# EasyEDA Pro project PCB.epro

# Board PCB1
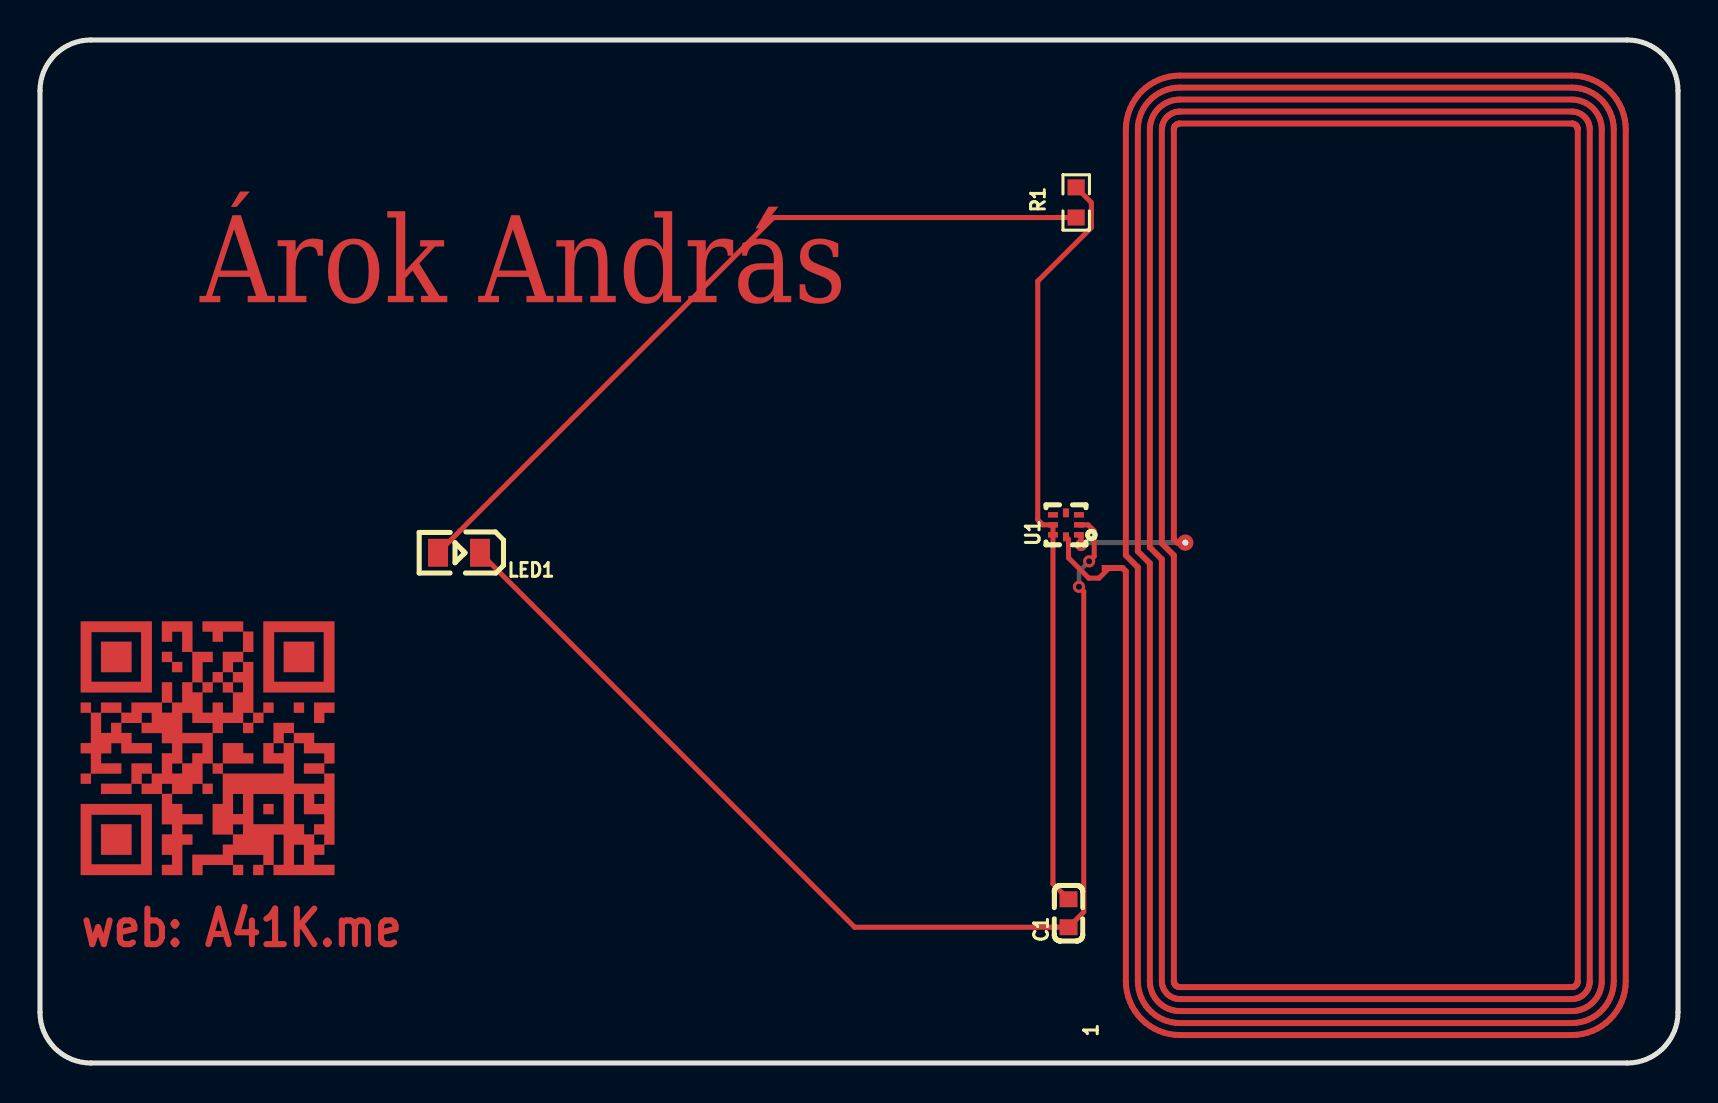
[diagram p0: board, top side]
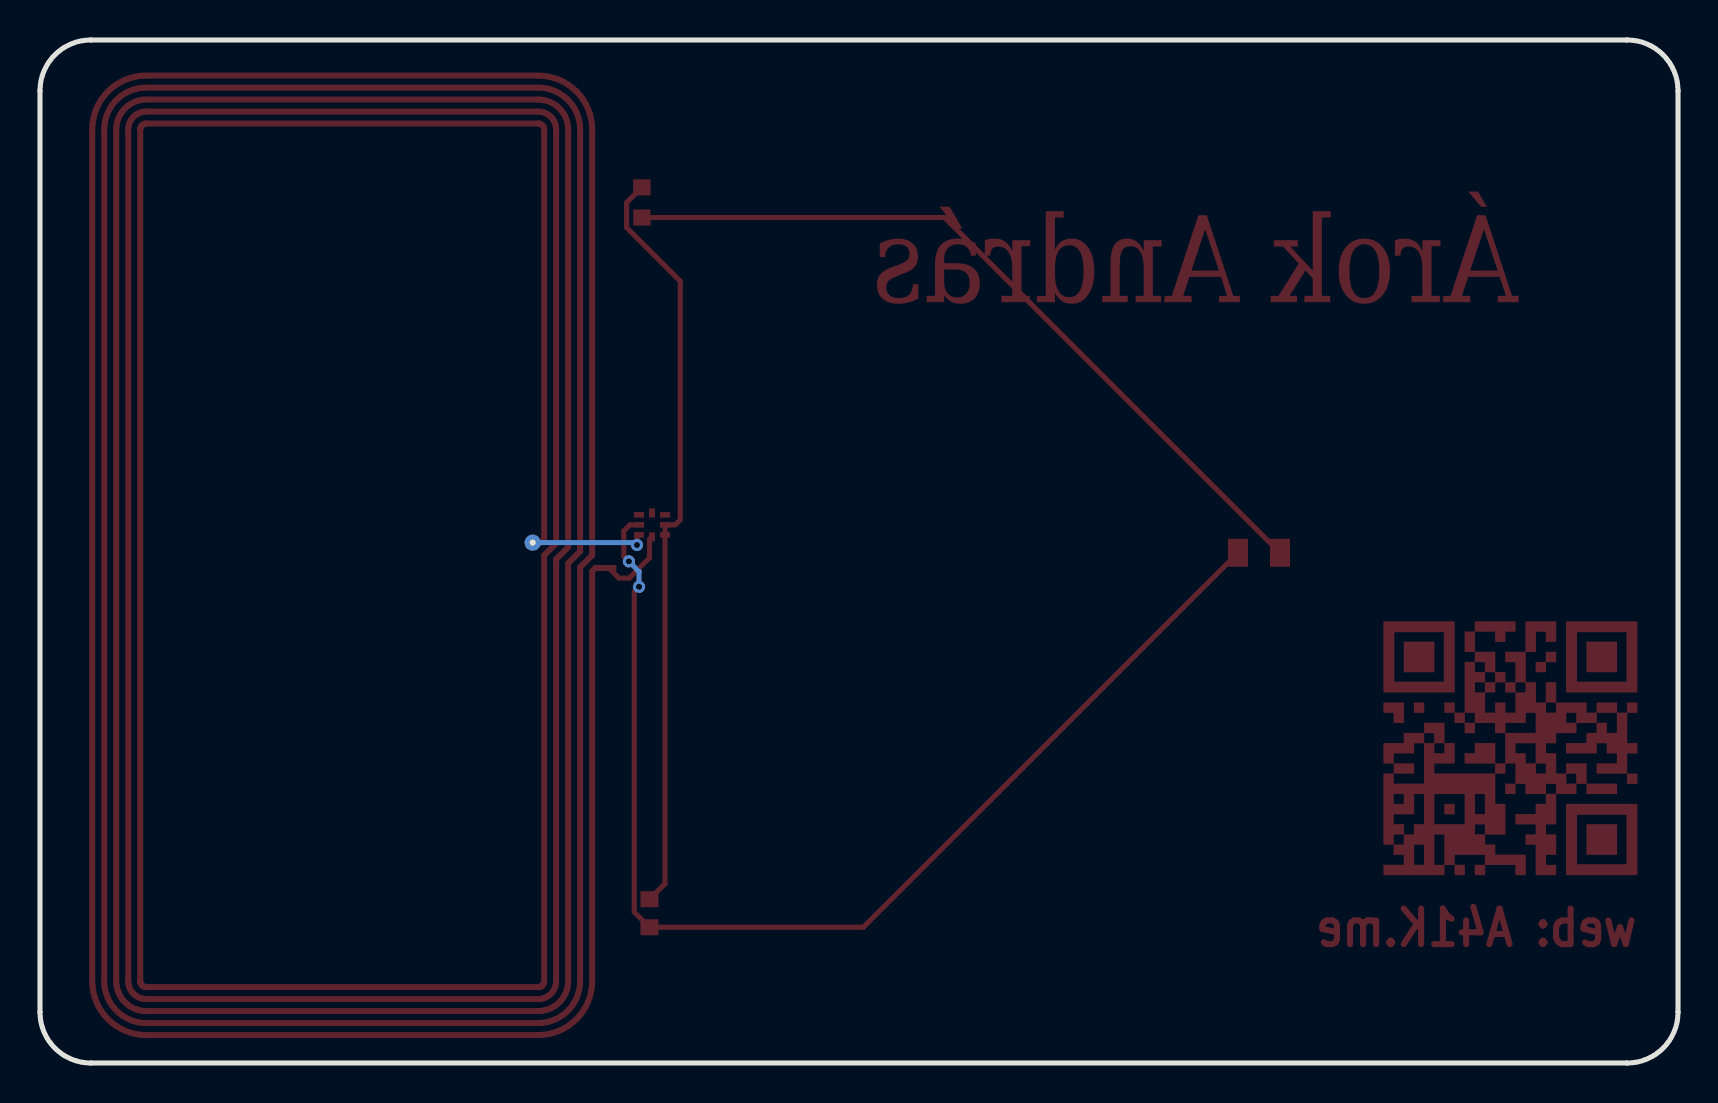
[diagram p1: board, bottom side, seen from below]

Outline 81.92 x 51.18 mm; copper layers: Top Layer, Bottom Layer. Coordinates in mm from the lower left corner of the outline.
Outline path: 0,48.64 0,2.54 arc(0.74,0.74) 2.54,0 79.37,0 arc(81.17,0.74) 81.92,2.54 81.92,48.64 arc(81.17,50.44) 79.37,51.18 2.54,51.18 arc(0.74,50.44) 0,48.64
Stack: Top Layer 0.035mm / Dielectric1 1.51mm FR4 er 4.5 / Bottom Layer 0.035mm

## Design rules (mm)
template: JLCPCB Capability(Two Layers Board)
spacing copperThickness1oz (default): track to track 0.102, other pairs 0.152 to 0.3
spacing copperThickness2oz: track to track 0.203, other pairs 0.152 to 0.3
track width copperThickness1oz (default): min 0.127, default 0.254, max 2.54
track width copperThickness2oz: min 0.203, default 0.254, max 2.54
differential pair differentialPair (default): width min 0.127, default 0.254, max 2.54; gap min 0.152, default 0.152
via viaSize (default): diameter min 0.5, default 0.61, max 10; hole min 0.3, default 0.305, max 6.3

## Placement (name value [footprint] x y rotation side)
1  -  [25X48MM_NFC_ANTENNA]  66.8 25.4 90 top
C1  220nF  [C0603]  51.43 7.49 90 top
LED1  KT-0805Y  [LED0805-R-RD]  20.95 25.53 180 top
R1  47Ω  [R0603]  51.82 43.05 90 top
U1  13.56MHz  [XQFN-8_L1.6-W1.6-P0.50-BL_NT3H2111W0FHKH]  51.31 26.92 90 top

## Footprints (pads in the part's own frame, mm; a bottom-side part is the same pattern mirrored in y, then rotated)
25X48MM_NFC_ANTENNA
  rect 0.3x0.75 smd: P$1(-0.635,13.335)
  round 0.808 hole 0.3x0.3: P$2(0.635,9.525)
C0603
  rect 0.8x0.9 smd: 1(-0.7,0) 2(0.7,0)
LED0805-R-RD
  rect 1x1.399 smd: 1(1.05,0) 2(-1.05,0)
R0603
  rect 0.806x0.864 smd: 1(-0.753,0) 2(0.753,0)
XQFN-8_L1.6-W1.6-P0.50-BL_NT3H2111W0FHKH
  rect 0.28x0.5 smd: 1(-0.5,-0.65) 2(0,-0.65) 3(0.5,-0.65) 5(0.5,0.65) 6(0,0.65) 7(-0.5,0.65)
  rect 0.45x0.3 smd: 4(0.6,0) 8(-0.6,0)

## Nets
$1N431: C1.1 LED1.2 U1.2
$1N456: LED1.1 R1.1
$1N466: C1.2 R1.2 U1.6 U1.7
$1N515: 1.P$2 U1.1
$1N553: 1.P$1 U1.8

Pads without a net: U1 3 4 5

## Via types
v1: diameter 0.61, hole 0.305, Top Layer to Bottom Layer, 3 vias

## Routing (per net, layer and track width the routed paths; a pad name or vN(x,y) marks a point on that pad's centre or on a via; arc(x,y) is an arc through that point)
$1N431: length 58.6
  Top Layer w0.254: v1(51.96,23.83) 52.2,23.59 52.2,7.55 C1.1 40.74,6.79 LED1.2 ; U1.2 52.42,26.92 52.72,26.62 52.72,25.35 v1(52.47,25.1)
  Bottom Layer w0.254: v1(51.96,23.83) 51.96,24.59 v1(52.47,25.1)
$1N456: length 38.9
  Top Layer w0.254: LED1.1 36.68,42.3 R1.1
$1N466: length 38
  Top Layer w0.254: R1.2 52.58,43.04 52.58,41.8 49.9,39.12 49.9,27.18 50.15,26.92 U1.6 U1.7 50.66,8.97 C1.2
$1N515: length 5.8
  Top Layer w0.254: U1.1 52.06,26.32 v1(52.06,25.92)
  Bottom Layer w0.254: 1.P$2 52.18,26.03 v1(52.06,25.92)
$1N553: length 3.8
  Top Layer w0.254: 1.P$1 52.96,24.26 52.45,24.26 51.43,25.27 51.43,26.2 U1.8

Small or netless copper shapes (teardrops, artwork), in the pictures only: 11 on Top Layer

## Text on the board
Top Layer: web: A41K.me | Árok András
Top Solder Mask Layer: web: A41K.me | gh: A41K | Árok András
